# EAGLE schematic 7segment (EAGLE 6.5.0)
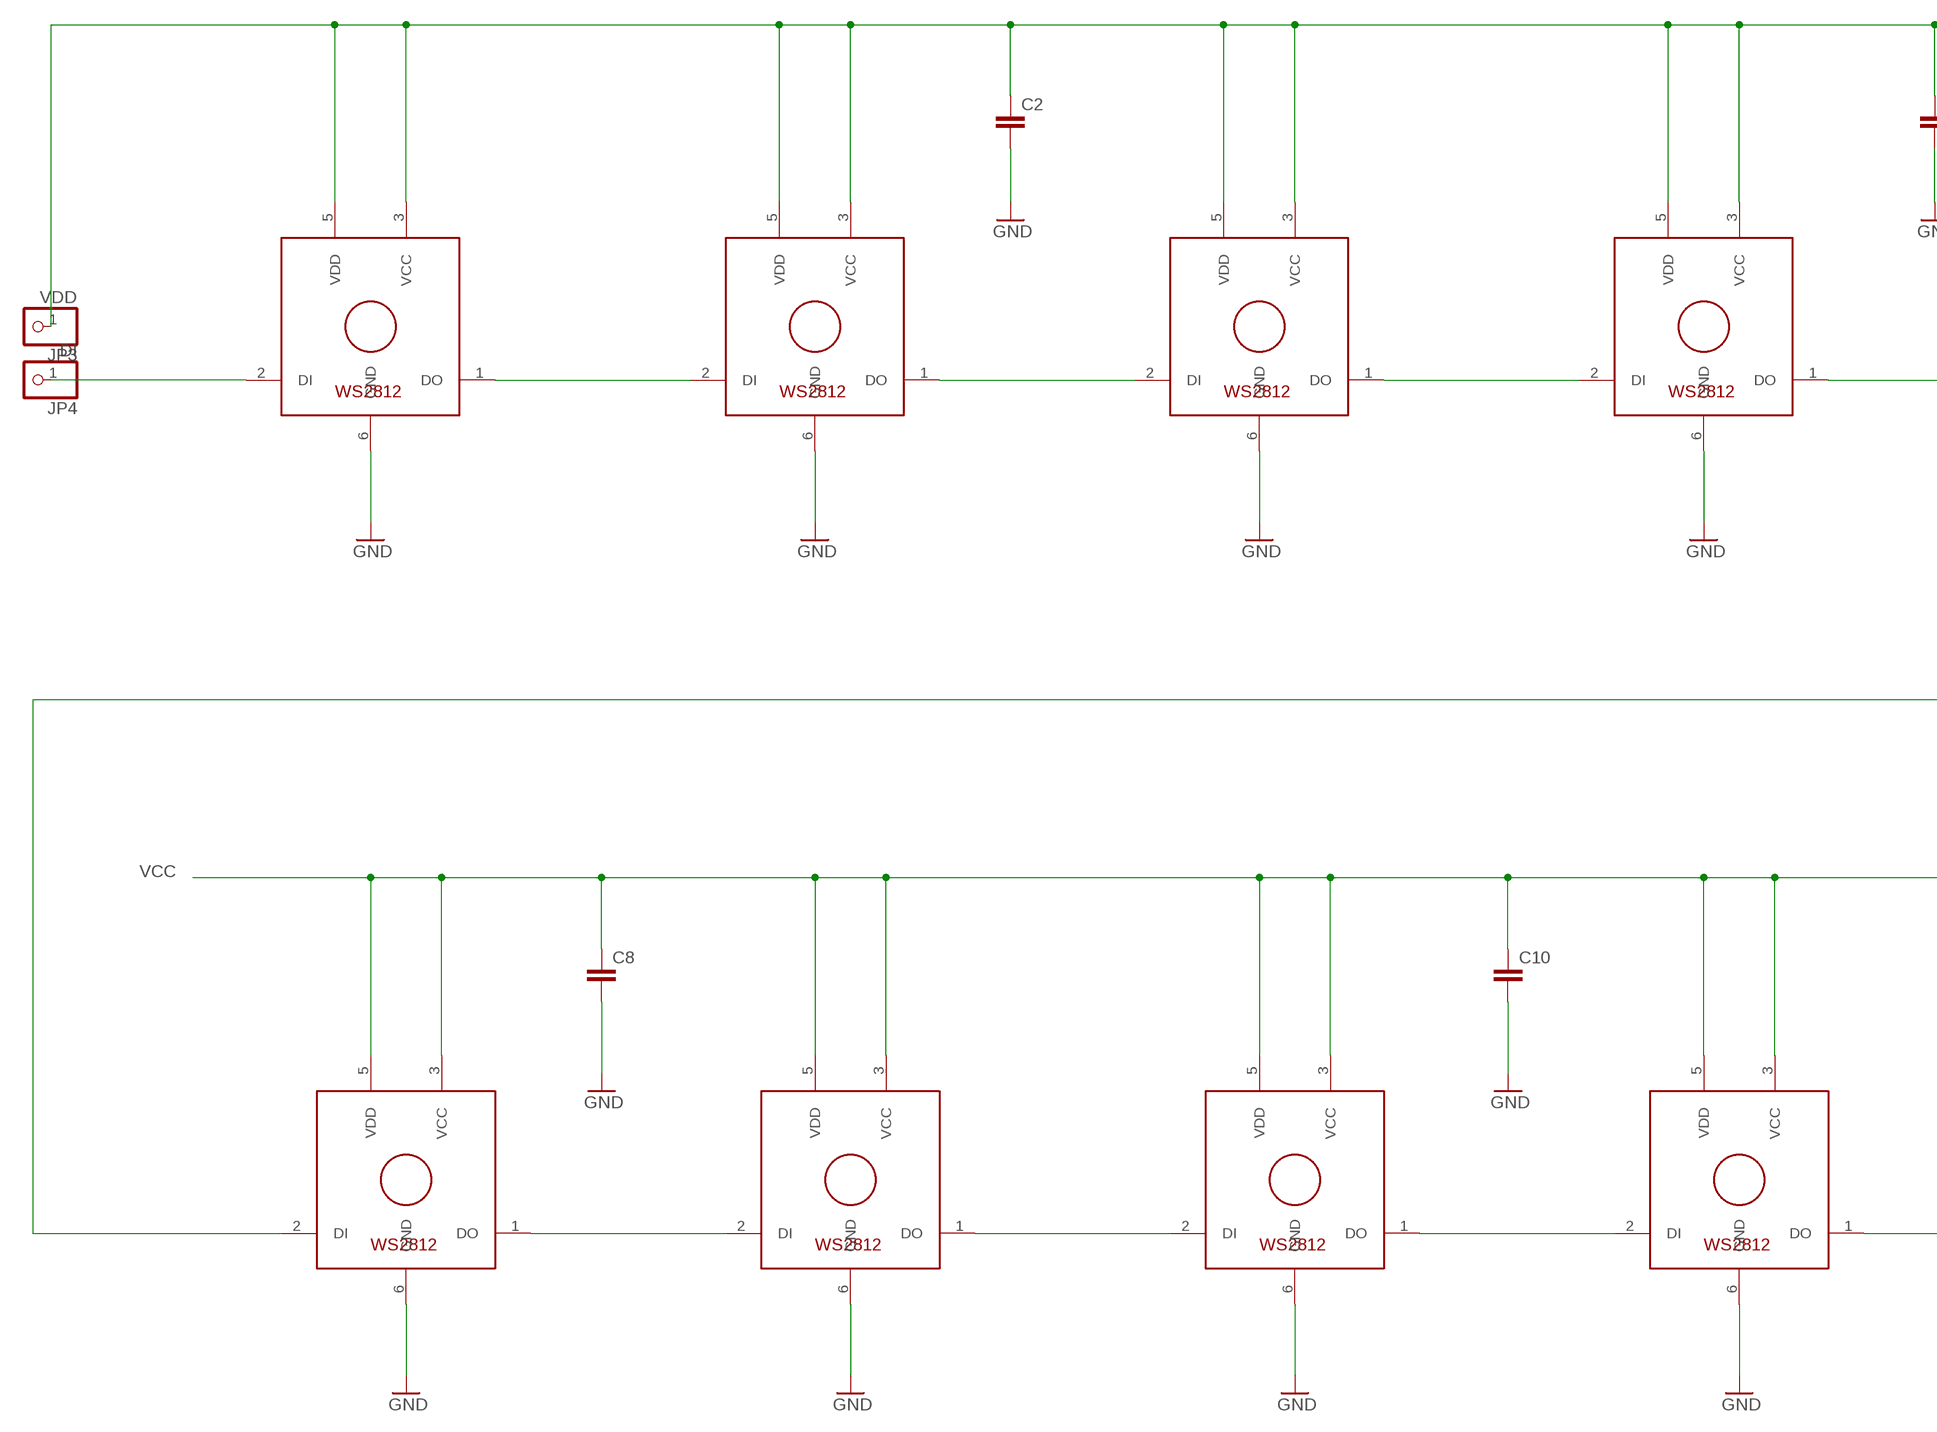
[diagram p0: schematic, sheet 1, part 1 of 2]
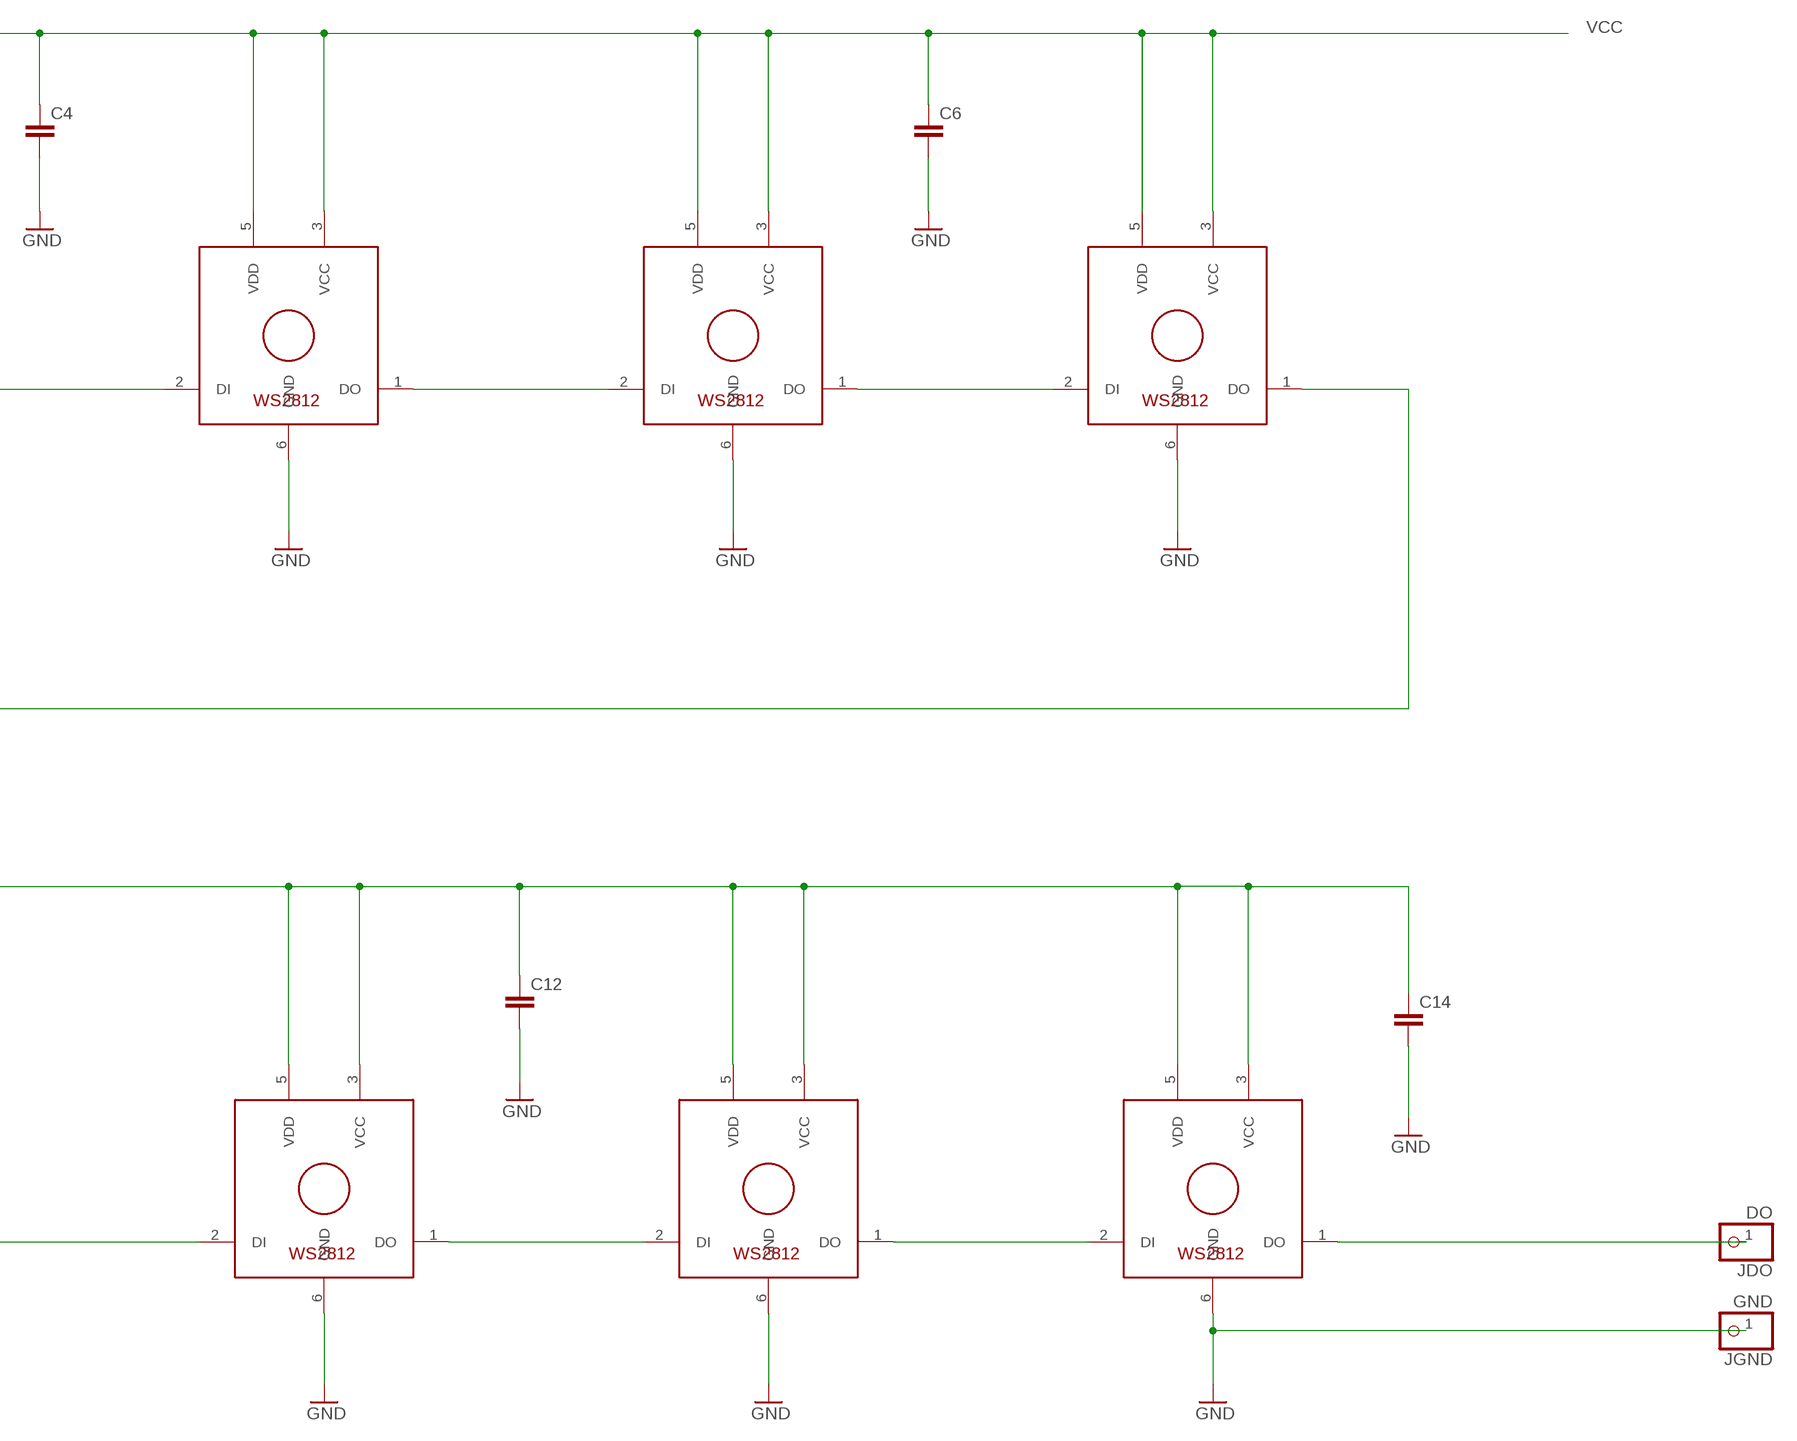
[diagram p1: schematic, sheet 1, part 2 of 2]

## Parts
C2  C-EUC1206  [C1206]
C4  C-EUC1206  [C1206]
C6  C-EUC1206  [C1206]
C8  C-EUC1206  [C1206]
C10  C-EUC1206  [C1206]
C12  C-EUC1206  [C1206]
C14  C-EUC1206  [C1206]
JDO  DO  PINHD-1X1  [1X01]
JGND  GND  PINHD-1X1  [1X01]
JP3  VDD  PINHD-1X1  [1X01]
JP4  DI  PINHD-1X1  [1X01]
U1  WS2812  [WS2812]
U2  WS2812  [WS2812]
U3  WS2812  [WS2812]
U4  WS2812  [WS2812]
U5  WS2812  [WS2812]
U6  WS2812  [WS2812]
U7  WS2812  [WS2812]
U8  WS2812  [WS2812]
U9  WS2812  [WS2812]
U10  WS2812  [WS2812]
U11  WS2812  [WS2812]
U12  WS2812  [WS2812]
U13  WS2812  [WS2812]
U14  WS2812  [WS2812]

## Nets
GND: C2.2 C4.2 C6.2 C8.2 C10.2 C12.2 C14.2 JGND.1 U1.6(GND) U2.6(GND) U3.6(GND) U4.6(GND) U5.6(GND) U6.6(GND) U7.6(GND) U8.6(GND) U9.6(GND) U10.6(GND) U11.6(GND) U12.6(GND) U13.6(GND) U14.6(GND)
JDI: JP4.1 U1.2(DI)
N$1: U1.1(DO) U2.2(DI)
N$2: U2.1(DO) U3.2(DI)
N$3: U7.1(DO) U8.2(DI)
N$4: JDO.1 U14.1(DO)
N$5: U3.1(DO) U4.2(DI)
N$7: U4.1(DO) U5.2(DI)
N$8: U5.1(DO) U6.2(DI)
N$9: U6.1(DO) U7.2(DI)
N$10: U8.1(DO) U9.2(DI)
N$11: U9.1(DO) U10.2(DI)
N$12: U10.1(DO) U11.2(DI)
N$13: U11.1(DO) U12.2(DI)
N$14: U12.1(DO) U13.2(DI)
N$15: U13.1(DO) U14.2(DI)
VCC: C2.1 C4.1 C6.1 C8.1 C10.1 C12.1 C14.1 JP3.1 U1.3(VCC) U1.5(VDD) U2.3(VCC) U2.5(VDD) U3.3(VCC) U3.5(VDD) U4.3(VCC) U4.5(VDD) U5.3(VCC) U5.5(VDD) U6.3(VCC) U6.5(VDD) U7.3(VCC) U7.5(VDD) U8.3(VCC) U8.5(VDD) U9.3(VCC) U9.5(VDD) U10.3(VCC) U10.5(VDD) U11.3(VCC) U11.5(VDD) U12.3(VCC) U12.5(VDD) U13.3(VCC) U13.5(VDD) U14.3(VCC) U14.5(VDD)

## Library data of the parts
C2 C4 C6 C8 C10 C12 C14 = resistor:C-EU: CAPACITOR, European symbol
JDO JGND JP3 JP4 = pinhead:PINHD-1X1: PIN HEADER
U1-U14 = n39:WS2812: WS2812 — Intelligent control LED integrated light source General description WS2812 is a intelligent control LED light source that the control circuit and RGB chip are integrated in a package of 5050 components. It internal include intelligent digital port data latch and signal reshaping amplification drive circuit. Also include a precision internal oscillator and a 12V voltage programmable constant curre-nt control part, effectively ensuring the pixel point light color height consistent. The data transfer protocol use single NZR communication mode. After the pixel power-on reset, the DIN port receive data from controller, the first pixel collect initial 24bit data then sent to the internal data latch, the other data which reshaping by the internal signal reshaping amplification circuit sent to the next cascade pixel through the DO port. After transmission for each pixel,the signal to reduce 24bit. pixel adopt auto resha -ping transmit technology, making the pixel cascade number is not limited the signal transmission, only depend on the speed of signal transmission. LED with low driving voltage, environmental protection and energy saving, high brightness, scattering angle is large, good consistency, low power, long life and other advantages. The control chip integrated in LED above becoming more simple circuit, small volume, convenient installation.